# EAGLE design rev10C (EAGLE 9.6.1)
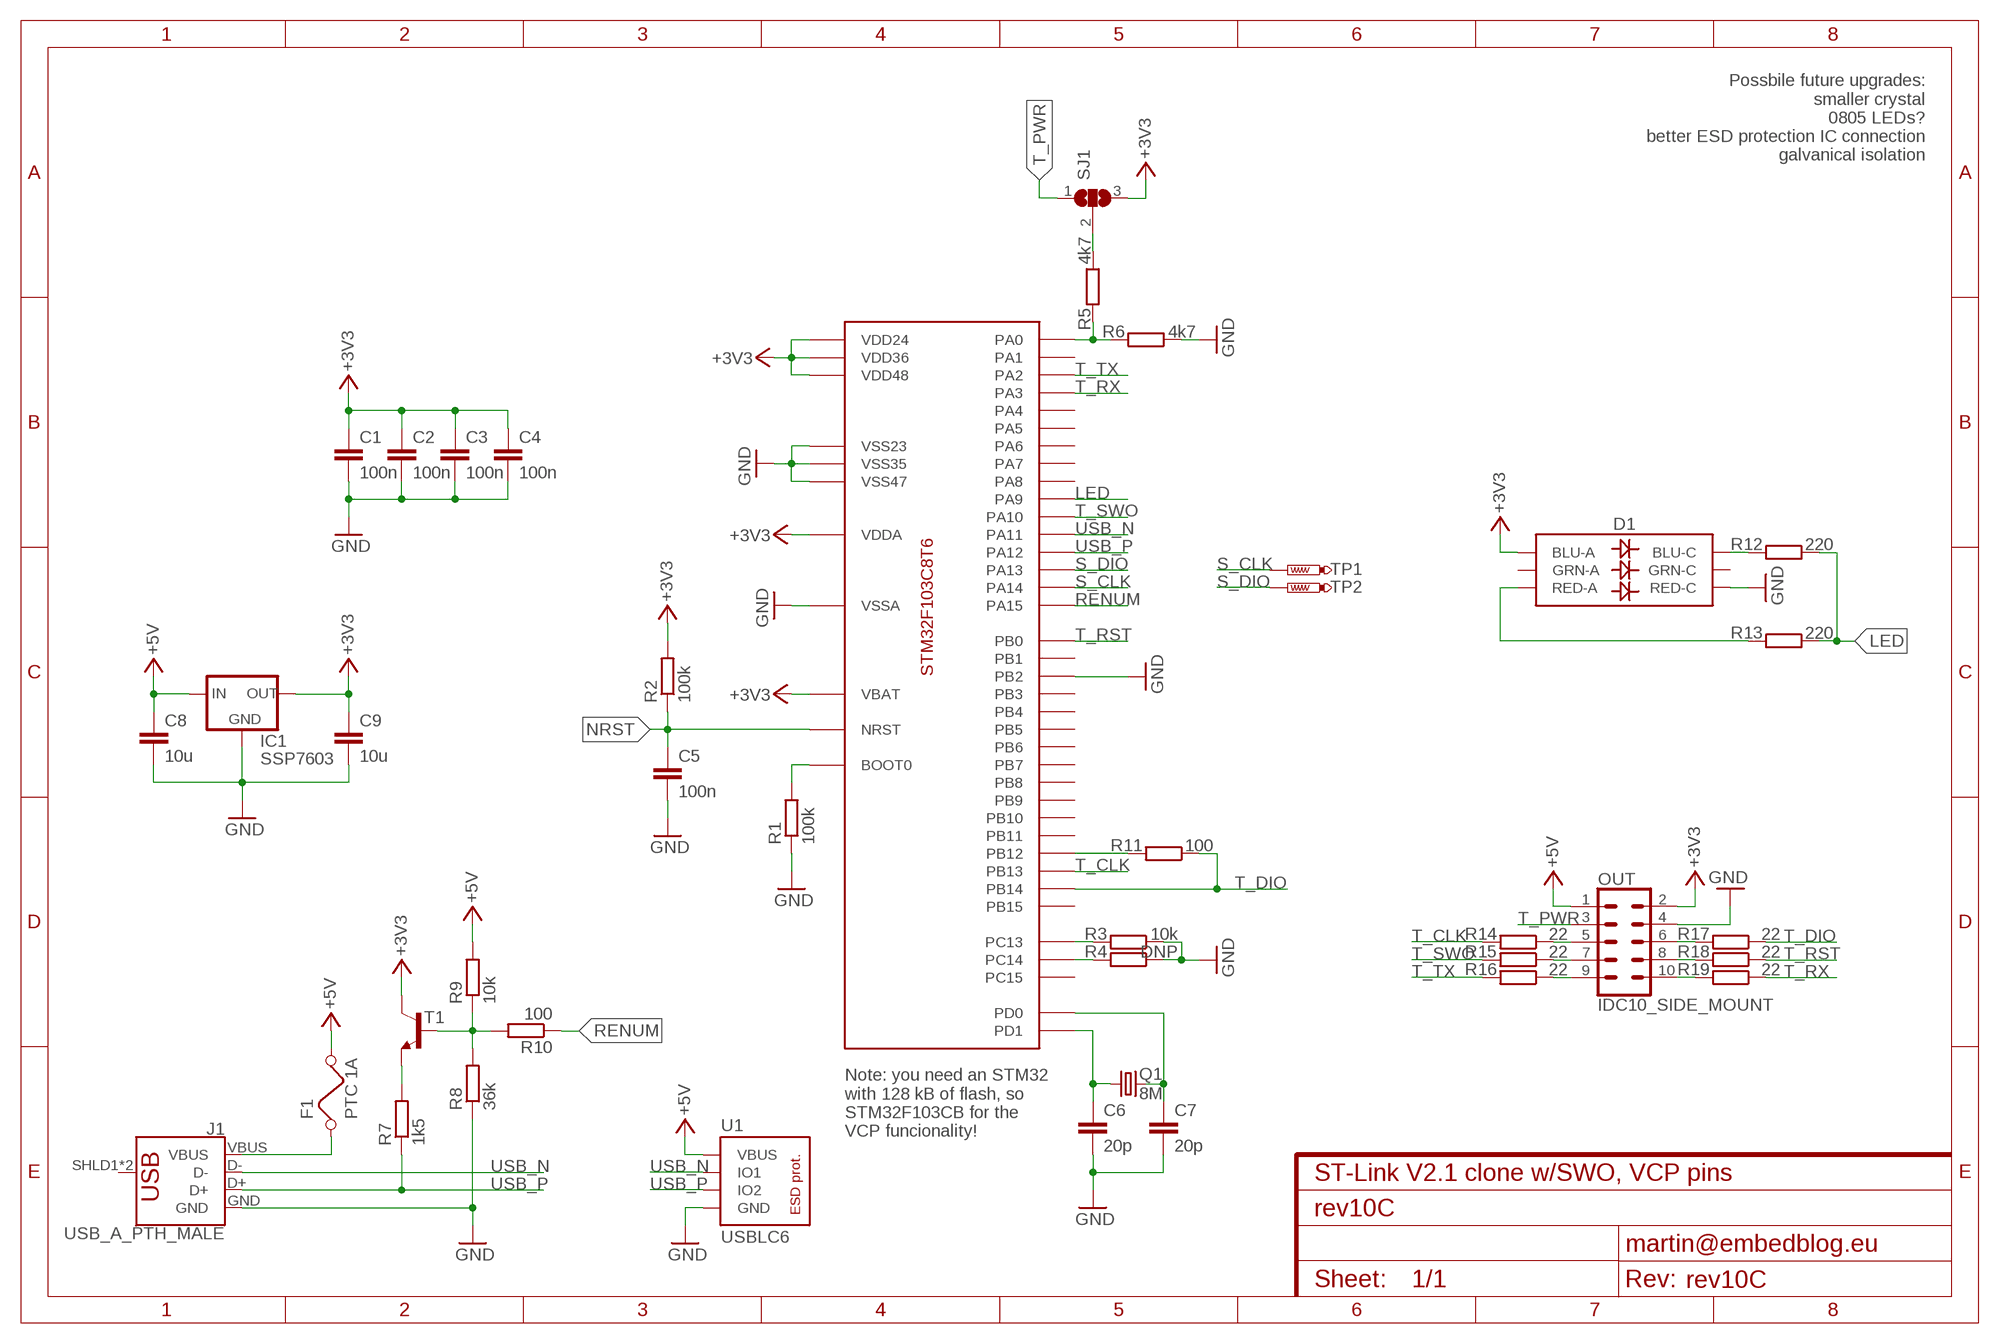
[diagram p0: schematic, sheet 1]
FRAME1 (FRAME-A4L): CNAME: ST-Link V2.1 clone w/SWO, VCP pins; CREVISION: rev10C; DESIGNER: martin@embedblog.eu

## Parts
C1  100n  C-EUC0603  [C0603]
C2  100n  C-EUC0603  [C0603]
C3  100n  C-EUC0603  [C0603]
C4  100n  C-EUC0603  [C0603]
C5  100n  C-EUC0603  [C0603]
C6  20p  C-EUC0805  [C0805]
C7  20p  C-EUC0805  [C0805]
C8  10u  C-EUC0805  [C0805]
C9  10u  C-EUC0805  [C0805]
D1  LED-RGBNO_IC  [LED-TRICOLOR-5050]
F1  PTC 1A  FUSEB  [0805]
IC1  SSP7603  XC63FPM  [SOT23]
IC2  STM32F103C8T6  [TQFP-48]
J1  USB_A_PTH_MALE  [USB-A-H]
OUT  IDC10_SIDE_MOUNT  [IDC10_SIDEWAYS]
Q1  8M  CRYSTALHC49S  [HC49/S]
R1  100k  R-EU_R0805  [R0805]
R2  100k  R-EU_R0805  [R0805]
R3  10k  R-EU_R0805  [R0805]
R4  DNP  R-EU_R0805  [R0805]
R5  4k7  R-EU_R0805  [R0805]
R6  4k7  R-EU_R0805  [R0805]
R7  1k5  R-EU_R0805  [R0805]
R8  36k  R-EU_R0805  [R0805]
R9  10k  R-EU_R0805  [R0805]
R10  100  R-EU_R0805  [R0805]
R11  100  R-EU_R0805  [R0805]
R12  220  R-EU_R0805  [R0805]
R13  220  R-EU_R0805  [R0805]
R14  22  R-EU_R0805  [R0805]
R15  22  R-EU_R0805  [R0805]
R16  22  R-EU_R0805  [R0805]
R17  22  R-EU_R0805  [R0805]
R18  22  R-EU_R0805  [R0805]
R19  22  R-EU_R0805  [R0805]
SJ1  SJ2W  [SJ_2]
T1  MMBT3904LT1-NPN-SOT23-BEC  [SOT23-BEC]
TP1  PTR1B1,27  [B1,27]
TP2  PTR1B1,27  [B1,27]
U1  USBLC6  [SOT23-6]

## Nets
+3V3: C1.1 C2.1 C3.1 C4.1 C9.1 D1.3(BLU-A) IC1.2(OUT) IC2.1(VBAT) IC2.9(VDDA) IC2.24(VDD24) IC2.36(VDD36) IC2.48(VDD48) OUT.2 R2.2 SJ1.3 T1.C
+5V: C8.1 F1.2 IC1.3(IN) OUT.1 R9.2 U1.5(VBUS)
GND: C1.2 C2.2 C3.2 C4.2 C5.2 C6.2 C7.2 C8.2 C9.2 D1.5(RED-C) IC1.1(GND) IC2.8(VSSA) IC2.20(PB2) IC2.23(VSS23) IC2.35(VSS35) IC2.47(VSS47) J1.GND OUT.4 R1.1 R3.1 R4.1 R6.1 R8.1 U1.2(GND)
LED: IC2.30(PA9) R12.1 R13.1
N$1: IC2.44(BOOT0) R1.2
N$2: IC2.3(PC14) R4.2
N$3: IC2.25(PB12) R11.2
N$4: IC2.2(PC13) R3.2
N$5: C6.1 IC2.6(PD1) Q1.1
N$6: C7.1 IC2.5(PD0) Q1.2
N$7: R7.2 T1.E
N$8: IC2.10(PA0) R5.2 R6.2
N$9: F1.1 J1.VBUS
N$10: R8.2 R9.1 R10.2 T1.B
N$11: D1.2(RED-A) R13.2
N$12: D1.4(BLU-C) R12.2
N$13: R5.1 SJ1.2
N$14: OUT.5 R14.1
N$15: OUT.7 R15.1
N$16: OUT.9 R16.1
N$17: OUT.6 R17.2
N$18: OUT.8 R18.2
N$19: OUT.10 R19.2
NRST: C5.1 IC2.7(NRST) R2.1
RENUM: IC2.38(PA15) R10.1
S_CLK: IC2.37(PA14) TP1.TP
S_DIO: IC2.34(PA13) TP2.TP
T_CLK: IC2.26(PB13) R14.2
T_DIO: IC2.27(PB14) R11.1 R17.1
T_PWR: OUT.3 SJ1.1
T_RST: IC2.18(PB0) R18.1
T_RX: IC2.13(PA3) R19.1
T_SWO: IC2.31(PA10) R15.2
T_TX: IC2.12(PA2) R16.2
USB_N: IC2.32(PA11) J1.D- U1.1(IO1) U1.6(IO1)
USB_P: IC2.33(PA12) J1.D+ R7.1 U1.3(IO2) U1.4(IO2)
Unconnected: D1.1(GRN-A) D1.6(GRN-C) IC2.4(PC15) IC2.11(PA1) IC2.14(PA4) IC2.15(PA5) IC2.16(PA6) IC2.17(PA7) IC2.19(PB1) IC2.21(PB10) IC2.22(PB11) IC2.28(PB15) IC2.29(PA8) IC2.39(PB3) IC2.40(PB4) IC2.41(PB5) IC2.42(PB6) IC2.43(PB7) IC2.45(PB8) IC2.46(PB9) J1.SHLD1(SHIELD) J1.SHLD2(SHIELD)

## Notes on the sheet
- Possbile future upgrades:
  smaller crystal
  0805 LEDs?
  better ESD protection IC connection
  galvanical isolation
- Note: you need an STM32
  with 128 kB of flash, so 
  STM32F103CB for the 
  VCP funcionality!

## Library data of the parts
C1-C9 = resistor:C-EU: CAPACITOR, European symbol
D1 = SparkFun-LED:LED-RGB: LED-RGB 6 pin RGB LED (no common connector) Packages: PLCC-6 LED-TRICOLOR-5050 - No built-in IC SparkFun Products: Digital Sandbox <https://www.sparkfun.com/products/12651> LED- SMD RGB <https://www.sparkfun.com/products/10866>; PROD_ID: DIO-10298
F1 = m-pad-2.1:FUSE: Fuse's in various packages
IC1 = v-reg:XC63FP: Positiv Voltage Regulators www.torex.co.jp/english/product/pro02/pdf/0201_xc62fp.pdf
IC2 = SparkFun-DigitalIC:STM32F103C8T6
J1 = SparkFun-Connectors:USB_A: USB-A Connector Male and female variants, as well as PTH and SMT variants SparkFun Products: SparkFun XBee Explorer Dongle <https://www.sparkfun.com/products/11697> PTH Male SparkFun MicroView-USB Programmer <https://www.sparkfun.com/products/12924> SMT Male SparkFun USB Type A Female Breakout <https://www.sparkfun.com/products/12700> SMT Female; PROD_ID: CONN-08367; SF_ID: PRT-00437
OUT = custom:IDC10_SIDE_MOUNT
Q1 = crystal:CRYSTAL: CRYSTAL; OC_FARNELL: 1667008; OC_NEWARK: unknown
R1-R19 = resistor:R-EU_: RESISTOR, European symbol
SJ1 = jumper:SJ2W: SMD solder JUMPER
T1 = transistor-neu-to92:*-NPN-: NPN Transistror
TP1 TP2 = testpad:PTR1: TEST PIN
U1 = custom:USBLC6

## Board
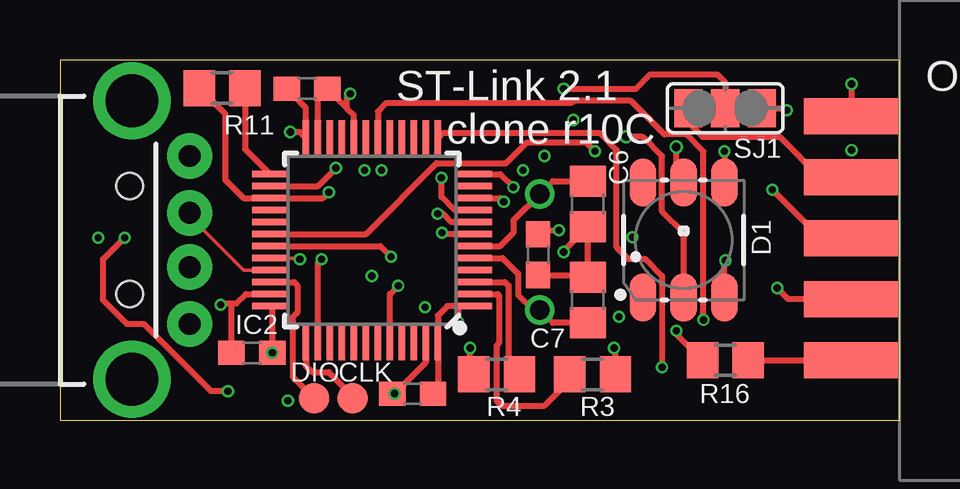
[diagram p1: board, top side]
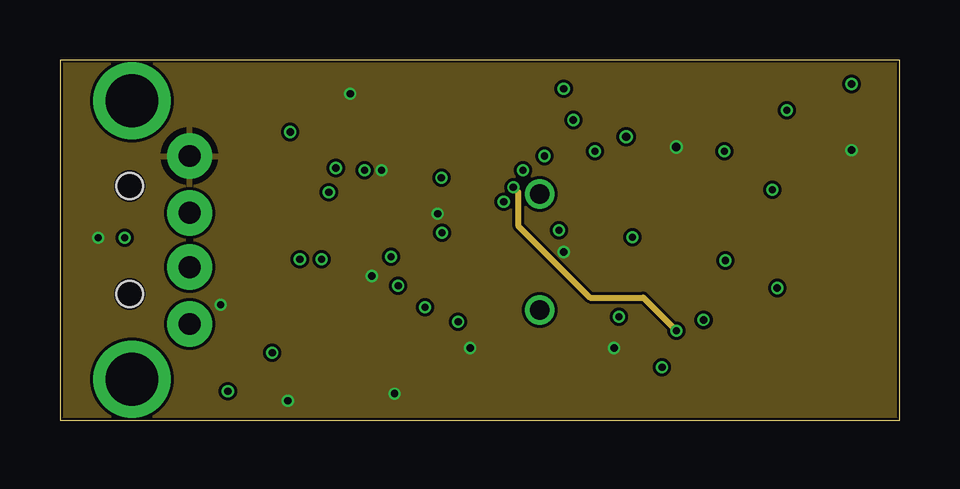
[diagram p2: board, inner layer Route2]
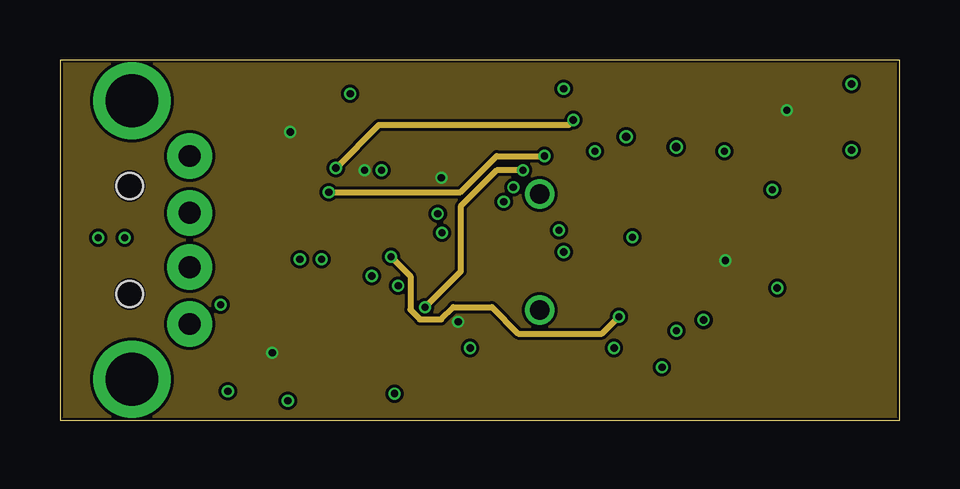
[diagram p3: board, inner layer Route15]
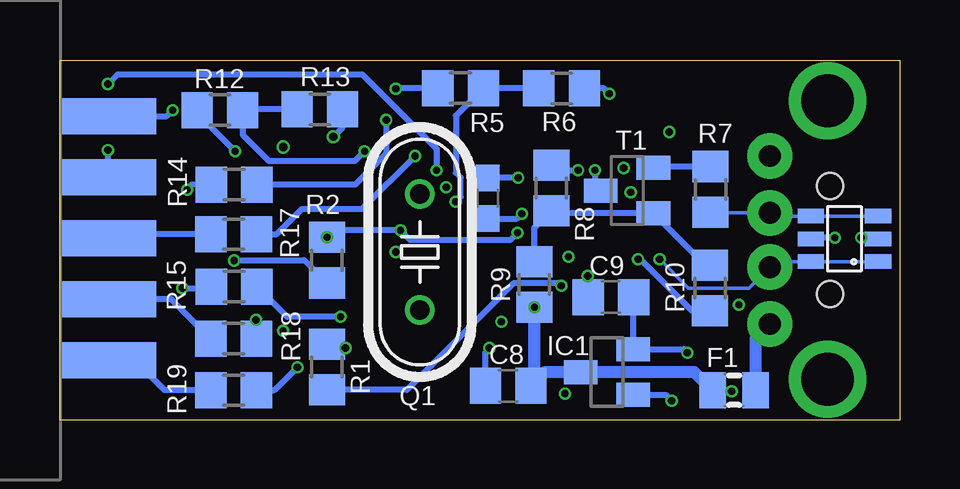
[diagram p4: board, bottom side, seen from below]

Size 35 x 15 mm. Coordinates in mm from the lower left corner, seen from the top.
Outline: 0,0 35,0 35,15 0,15 0,0
Copper layers (1*2*15*16): Top 0.035559375mm / dielectric 0.17018125mm / Route2 0.01778125mm / dielectric 47mil / Route15 0.01778125mm / dielectric 0.17018125mm / Bottom 0.035559375mm
Design rules "jlcpcb-4-layer": minimum track width 5mil, minimum drill 0.2mm, track to track 0.126490625mm, track to pad 0.126490625mm, pad to pad 0.126490625mm, via to via 0.126490625mm, smd to smd 0mil, copper to edge 0.1mm, drill to drill 5mil, minimum pad ring 4mil, minimum via ring 4mil, stop-mask expansion 3mil, vias tented up to drill 100mil, thermal gap 10mil

### Footprints (pad centres in the part's own frame; a part is rotated, then mirrored left to right if it is on the bottom)
C0603 = smd 1.1 x 1: 1 -0.85,0; 2 0.85,0
C0805 = smd 1.3 x 1.5: 1 -0.95,0; 2 0.95,0
LED-TRICOLOR-5050 = smd 2 x 1.1: 1 -2.4,1.7; 2 -2.4,0; 3 -2.4,-1.7; 4 2.4,-1.7; 5 2.4,0; 6 2.4,1.7
0805 = smd 1.1 x 1.5: 1 -0.9,0; 2 0.9,0
SOT23 = smd 1 x 1.4: 1 -0.95,-1.1; 2 0.95,-1.1; 3 0,1.1
TQFP-48 = smd 1.5 x 0.28: 1 -4.25,2.75; 2 -4.25,2.25; 3 -4.25,1.75; 4 -4.25,1.25; 5 -4.25,0.75; 6 -4.25,0.25; 7 -4.25,-0.25; 8 -4.25,-0.75; 9 -4.25,-1.25; 10 -4.25,-1.75; 11 -4.25,-2.25; 12 -4.25,-2.75; 25 4.25,-2.75; 26 4.25,-2.25; 27 4.25,-1.75; 28 4.25,-1.25; 29 4.25,-0.75; 30 4.25,-0.25; 31 4.25,0.25; 32 4.25,0.75; 33 4.25,1.25; 34 4.25,1.75; 35 4.25,2.25; 36 4.25,2.75 | smd 0.28 x 1.5: 13 -2.75,-4.25; 14 -2.25,-4.25; 15 -1.75,-4.25; 16 -1.25,-4.25; 17 -0.75,-4.25; 18 -0.25,-4.25; 19 0.25,-4.25; 20 0.75,-4.25; 21 1.25,-4.25; 22 1.75,-4.25; 23 2.25,-4.25; 24 2.75,-4.25; 37 2.75,4.25; 38 2.25,4.25; 39 1.75,4.25; 40 1.25,4.25; 41 0.75,4.25; 42 0.25,4.25; 43 -0.25,4.25; 44 -0.75,4.25; 45 -1.25,4.25; 46 -1.75,4.25; 47 -2.25,4.25; 48 -2.75,4.25
USB-A-H = drill 0.914 pad 1.88: D+ 2.4,1.127; D- 2.4,-1.127; GND 2.4,3.5; VBUS 2.4,-3.5 | drill 2.2: SHLD1 0,-5.8; SHLD2 0,5.8 | hole 1.1: -0.1,2.25; -0.1,-2.25
IDC10_SIDEWAYS = smd 4 x 1.5: 1 0,0.16; 3 0,-2.38; 5 0,-4.92; 7 0,-7.46; 9 0,-10 | smd 4 x 1.5 bottom: 2 0,0.16; 4 0,-2.38; 6 0,-4.92; 8 0,-7.46; 10 0,-10
HC49/S = drill 0.813: 1 -2.413,0; 2 2.413,0
R0805 = smd 1.3 x 1.5: 1 -0.95,0; 2 0.95,0
SJ_2 = smd 1.168 x 1.6: 1 -1.524,0; 2 0,0; 3 1.524,0
SOT23-BEC = smd 1 x 1.4: B -0.95,-1.1; C 0,1.1; E 0.95,-1.1
B1,27 = smd 1.27 x 1.27: TP 0,0
SOT23-6 = smd 0.6 x 1.1: 1 0,0; 2 0.95,0; 3 1.9,0; 4 1.9,2.8; 5 0.95,2.8; 6 0,2.8

### Placement (x,y rotation side)
C1  14.7,1.1 180 top
C2  8,2.8 180 top
C3  10.3,13.8 0 top
C4  17.17,9.24 270 bottom
C5  19.93,6.89 270 top
C6  22,9 270 top
C7  22,5 90 top
C8  16.31,1.42 180 bottom
C9  12.03,5.12 180 bottom
D1  26,7.5 90 top
F1  6.9,1.24 180 bottom
IC1  12.2,2 90 bottom
IC2  13,7.5 180 top
J1  3,7.5 0 top
OUT  33,12.5 0 top
Q1  20,7 270 bottom
R1  23.87,2.21 270 bottom
R2  23.87,6.66 270 bottom
R3  22.2,1.9 180 top
R4  18.2,1.9 0 top
R5  18.3,13.83 0 bottom
R6  14.09,13.82 180 bottom
R7  7.88,9.61 90 bottom
R8  14.52,9.67 270 bottom
R9  15.22,5.65 270 bottom
R10  7.9,5.5 90 bottom
R11  6.76,13.83 0 top
R12  28.33,12.91 180 bottom
R13  24.17,12.94 0 bottom
R14  27.74,9.81 0 bottom
R15  27.74,5.56 0 bottom
R16  27.74,2.49 180 top
R17  27.76,7.74 180 bottom
R18  27.76,3.39 180 bottom
R19  27.76,1.24 180 bottom
SJ1  27.73,12.99 0 top
T1  11.36,9.56 90 bottom
TP1  12.2,0.9 0 top
TP2  10.6,0.9 0 top
U1  0.9,6.6 90 bottom

### Tracks (layer width: path | path; a pad name or v marks a point on that pad's centre or on a via)
+3V3  (via drill 0.3)
  Top 0.254: C3.1 10.25,13 IC2.24 10,12 v9.6,12 | IC2.36 8.85,4.65 C2.1 | C1.1 15.75,1.3 IC2.48 15.75,4.35 16.15,4.75 IC2.1 16.65,4.75 16.6,4.7 v16.6,4.1 | IC2.9 16.45,8.75 15.9,9.3 v15.9,10.1 | D1.3 27.7,6.61 v27.74,6.64 | SJ1.3 30.22,12.99 v30.31,12.9
  Bottom 0.254: IC1.2 10.81,2.95 | v12.7,10.4 12.7,9.8 T1.C | IC1.2 11.1,5.1 C9.1 | IC1.2 9,2.95 C2.1 | v15.9,10.1 C4.1 | R2.2 24.82,6.66 27.72,6.66 v27.74,6.64 | OUT.2 30.55,12.66 v30.31,12.9
  other vias: 8.85,2.8
  pour Route15: 0,15 35,15 35,0 0,0
+5V  (via drill 0.3)
  Top 0.254: v7,1.2 6.3,1.2 3.5,4 2.8,4 1.8,5 1.8,6.7 v2.7,7.6 | OUT.1 v33,14
  Route15 0.254: v19.3,10.4 18.2,10.4 16.7,8.9 16.7,6.18 R9.2
  Bottom 0.254: F1.2 7.04,1.24 v7,1.2 | v2.7,7.6 3.65,7.6 U1.5 | v33,14 32.6,14.4 22.4,14.4 19.3,11.3 v19.3,10.4
  Bottom 0.508: F1.2 8.56,2 IC1.3 14.78,2 C8.1 15.22,1.56 R9.2
  other vias: 15.22,4.7
GND  (via drill 0.3, 0.35)
  Top 0.254: IC2.23 10.75,13.4 C3.2 11.97,12.97 | IC2.20 12.25,12.7 11.97,12.97 | 11.97,12.97 11.97,13.47 v12.1,13.6 | C2.2 7.15,4.85 | IC2.35 7.75,5.25 7.35,4.85 7.15,4.85 | 7.15,4.85 6.75,4.85 v6.7,4.8 | C7.2 22,6 | 22,6 C6.2 21,7.05 v21,7 | C5.2 21.96,6.04 22,6 | IC2.47 15.25,2.4 v13.95,1.1 C1.2 | IC2.8 16.31,8.25 15.96,8.6 v15.75,8.6 | R4.1 17.1,2.05 v17.1,3 | R3.1 23.15,2.95 v23.1,3 | D1.5 25.7,10.21 v25.7,11.37
  Bottom 0.254: v12.1,13.6 12.32,13.82 R6.1 | IC1.1 9.75,1.05 v9.5,0.8 | R8.1 14.3,10.4 v13.4,10.4 | C9.2 12.98,5.98 v13,6 | C4.2 15.96,8.39 v15.75,8.6 | OUT.4 v33,11.25 | U1.2 1.55,7.55 v1.6,7.6 | R1.1 23.71,3 v23.1,3 | C8.2 17.26,2.84 v17.1,3
  pour Route2: 0,15 35,15 35,0 0,0
LED  (via drill 0.3)
  Top 0.254: IC2.30 12.75,7.75 15.7,10.7 18.6,10.7 19.47,11.57 21.93,11.57 v22.3,11.2
  Bottom 0.254: R13.1 27.35,12.94 R12.1 27.38,11.88 26.3,10.8 22.7,10.8 v22.3,11.2
N$1  (via drill 0.3)
  Top 0.254: IC2.44 13.75,5.25 v14.1,5.6
  Bottom 0.254: v14.1,5.6 14.2,5.7 16.1,5.7 20.54,1.26 R1.2
N$2
  Top 0.254: IC2.3 18.55,5.75 18.7,5.6 18.7,2.35 R4.2
N$3
  Top 0.254: R11.2 7.71,11.29 IC2.25
N$4
  Top 0.254: IC2.2 18.25,5.25 18.3,5.2 18.3,3.2 18.2,3.1 18.2,0.8 18.4,0.6 20.2,0.6 21.25,1.65 R3.2
N$5
  Top 0.254: IC2.6 18.35,7.25 18.9,7.8 18.9,8.31 Q1.1 20.54,9.95 C6.1
N$6
  Top 0.254: IC2.5 18.45,6.75 19.1,6.1 19.1,5.2 19.71,4.59 Q1.2 20.54,4.05 C7.1
N$7
  Bottom 0.254: R7.2 10.21,10.56 T1.E
N$8  (via drill 0.3)
  Top 0.254: IC2.10 18.35,9.25 v18.5,9.1
  Bottom 0.254: R6.2 R5.2 18.5,12.68 18.5,10.3 18.3,10.1 18.3,9.3 v18.5,9.1
N$9
  Bottom 0.508: F1.1 6,3.4 J1.VBUS
N$10
  Bottom 0.254: R10.2 8.1,6.45 T1.B 14.41,8.61 R8.2 15.22,8.02 R9.1
N$11  (via drill 0.35)
  Top 0.254: 26.3,4.8 D1.2 26,7.8 25.1,8.7 25.1,11 24.3,11.8 v23.6,11.8
  Bottom 0.254: v23.6,11.8 23.22,12.18 R13.2
N$12  (via drill 0.3)
  Top 0.254: v27.7,11.2 D1.4
  Bottom 0.254: R12.2 29.28,12.78 v27.7,11.2
N$13  (via drill 0.3)
  Top 0.254: v21,13.8 24,13.8 24.6,14.4 27.4,14.4 27.73,14.07 SJ1.2
  Bottom 0.254: R5.1 20.97,13.83 v21,13.8
N$14  (via drill 0.3)
  Top 0.254: OUT.5 31.72,7.58 v29.7,9.6
  Bottom 0.254: R14.1 29.49,9.81 v29.7,9.6
N$15  (via drill 0.3)
  Top 0.254: OUT.7 30.36,5.04 v29.9,5.5
  Bottom 0.254: v29.9,5.5 28.75,5.5 R15.1
N$16
  Top 0.254: R16.1 OUT.9
N$17
  Bottom 0.254: R17.2 32.84,7.74 OUT.6
N$18
  Bottom 0.254: R18.2 30.36,5.04 OUT.8
N$19
  Bottom 0.254: R19.2 30.64,1.24 31.9,2.5 OUT.10
NRST  (via drill 0.3)
  Top 0.254: C5.1 20.09,7.9 v20.8,7.9 | IC2.7 15.97,7.75 v15.93,7.8
  Bottom 0.254: v15.93,7.8 16.23,7.5 20.4,7.5 v20.8,7.9 23.58,7.9 R2.1
  other vias: 23.87,7.61
RENUM  (via drill 0.3)
  Top 0.254: IC2.38 10.75,6.55 v10.9,6.7
  Bottom 0.254: R10.1 8.65,4.55 10.8,6.7 v10.9,6.7
S_CLK
  Top 0.254: IC2.37 10.25,2.25 10.5,2 11.2,2 12.2,1 TP1.TP
S_DIO
  Top 0.254: IC2.34 9.75,5.75 9.9,5.6 9.9,4.5 9.7,4.3 9.7,4 9.7,3.7 9.7,1.8 TP2.TP
T_CLK  (via drill 0.3)
  Top 0.254: IC2.26 10.75,9.75 v11.5,10.5
  Route15 0.254: v11.5,10.5 13.3,12.3 21.2,12.3 v21.4,12.5
  Bottom 0.254: v21.4,12.5 21.4,11.1 22.69,9.81 R14.2
T_DIO  (via drill 0.3)
  Top 0.254: R11.1 6.9,12.74 6.9,10 7.65,9.25 IC2.27 10.96,9.25 v11.21,9.49
  Route15 0.254: v11.21,9.49 16.69,9.49 18.2,11 v20.2,11
  Bottom 0.254: R17.1 25.96,7.74 24.9,8.8 22.4,8.8 v20.2,11
T_PWR
  Top 0.254: SJ1.1 26.41,12.79 26.41,12.19 26.8,11.8 30,11.8 31.7,10.1 32.98,10.1 OUT.3
T_RST  (via drill 0.3)
  Top 0.254: v26.83,4.17 26.83,11.18 26.11,11.9 25.2,11.9 23.8,13.3 21.4,13.3 21.3,13.2 13.6,13.2 13.25,12.85 IC2.18
  Bottom 0.254: R18.1 26.81,4.15 v26.83,4.17
T_RX  (via drill 0.3)
  Top 0.254: IC2.13 15.95,11.95 22.5,11.95 23.2,11.25 23.2,7.2 23.7,6.7 24.4,6.7 25.1,6 v25.1,2.2
  Bottom 0.254: R19.1 26.06,1.24 v25.1,2.2
T_SWO  (via drill 0.3)
  Top 0.254: IC2.31 13.35,7.25 v13.8,6.8
  Route15 0.254: v13.8,6.8 14.61,6 14.61,4.59 15.01,4.2 15.89,4.2 16.4,4.7 18,4.7 19.1,3.6 22.6,3.6 v23.3,4.3
  Bottom 0.254: v23.3,4.3 25.53,4.3 R15.2
T_TX  (via drill 0.3)
  Top 0.254: R16.2 25.7,3.58 v25.7,3.72 | IC2.12 18.35,10.25 v18.9,9.7
  Route2 0.254: v18.9,9.7 19.1,9.5 19.1,8.1 22.1,5.1 24.32,5.1 v25.7,3.72
USB_N  (via drill 0.3)
  Top 0.152: IC2.32 9.95,6.75 v10,6.7
  Bottom 0.152: v10,6.7 8.8,5.5 6.27,5.5 J1.D- 5.17,6.6 U1.6 U1.1
USB_P
  Top 0.152: IC2.33 7.65,6.25 5.4,8.5 J1.D+
  Bottom 0.152: R7.1 7.85,8.63 J1.D+ 5.27,8.5 U1.4 U1.3

### Text on the board
tPlace: ST-Link 2.1 | clone r10C | DIO | CLK